# EAGLE design Motor_board (EAGLE 7.3.0)
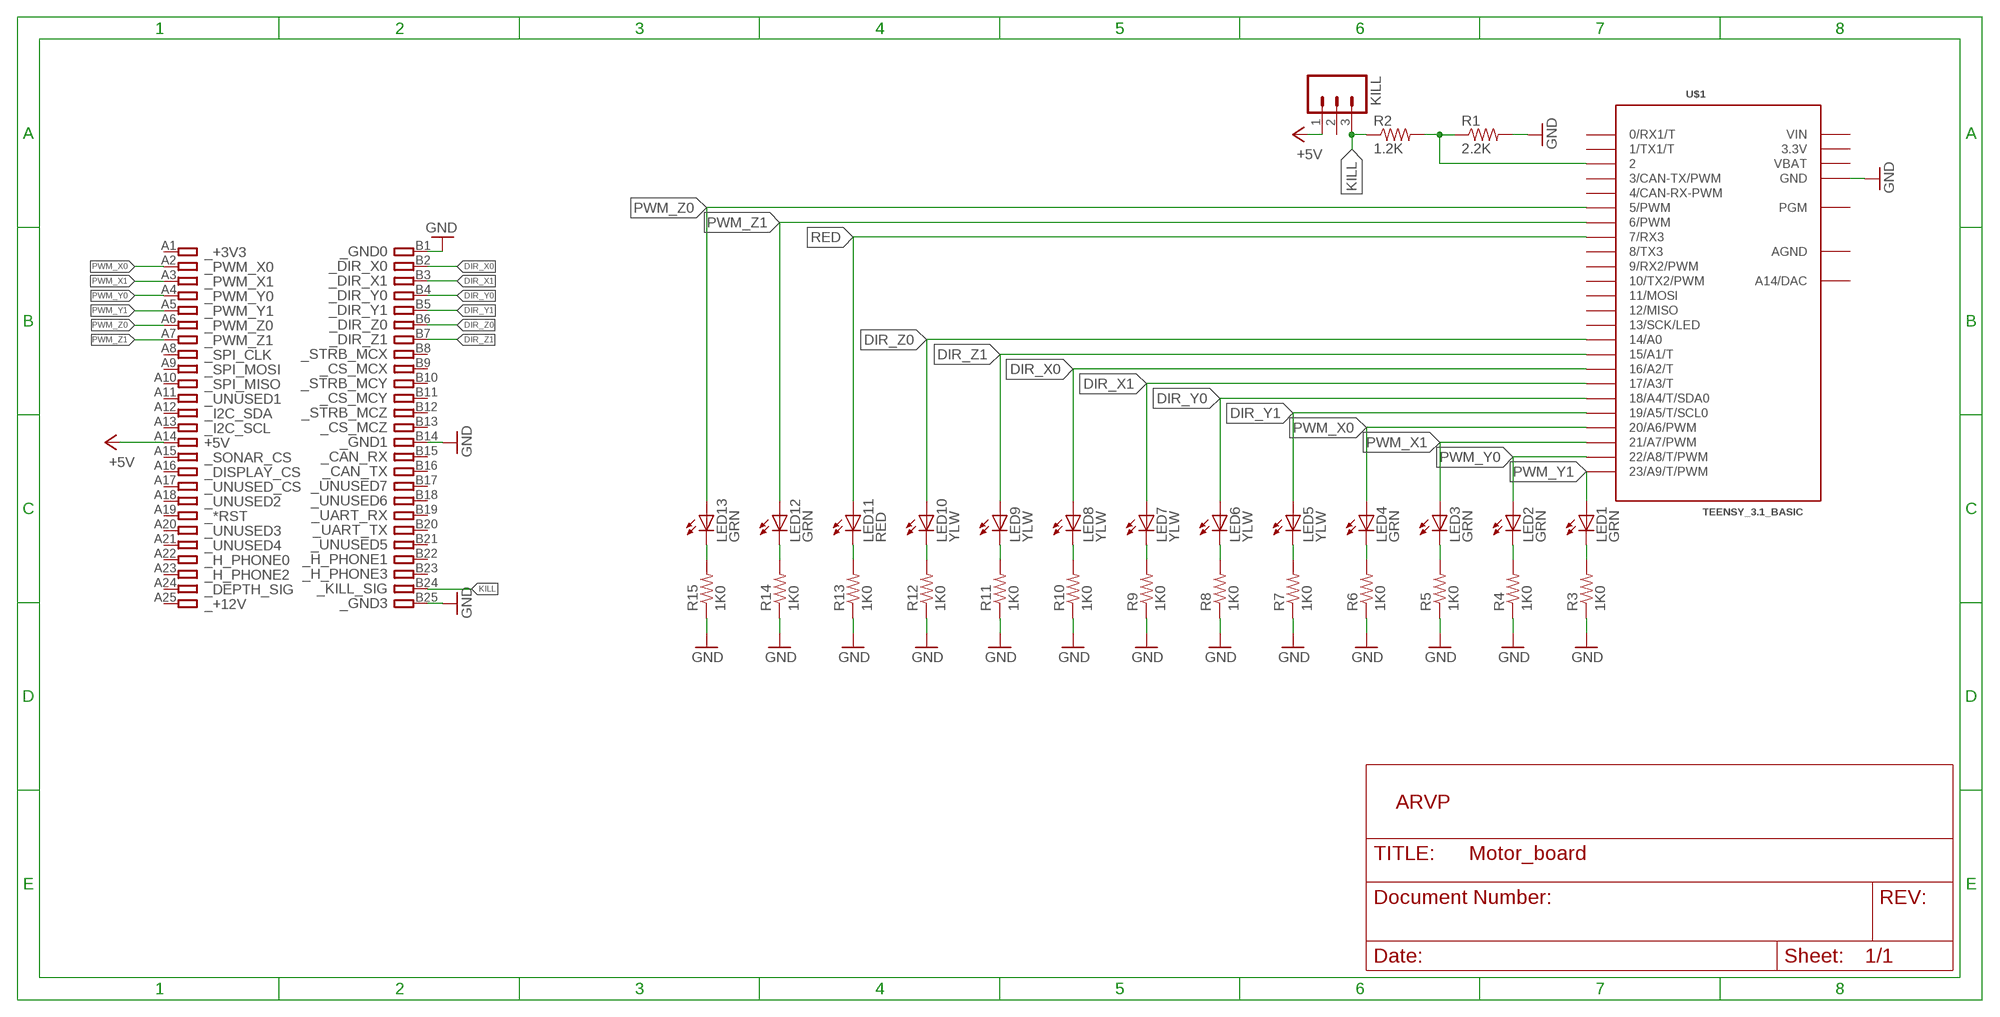
[diagram p0: schematic, sheet 1]

## Parts
KILL  M03LONGPADS  [1X03_LONGPADS]
LED1  GRN  LED1206  [LED-1206]
LED2  GRN  LED1206  [LED-1206]
LED3  GRN  LED1206  [LED-1206]
LED4  GRN  LED1206  [LED-1206]
LED5  YLW  LED1206  [LED-1206]
LED6  YLW  LED1206  [LED-1206]
LED7  YLW  LED1206  [LED-1206]
LED8  YLW  LED1206  [LED-1206]
LED9  YLW  LED1206  [LED-1206]
LED10  YLW  LED1206  [LED-1206]
LED11  RED  LED1206  [LED-1206]
LED12  GRN  LED1206  [LED-1206]
LED13  GRN  LED1206  [LED-1206]
R1  2.2K  RESISTOR1206  [1206]
R2  1.2K  RESISTOR1206  [1206]
R3  1K0  RESISTOR1206  [1206]
R4  1K0  RESISTOR1206  [1206]
R5  1K0  RESISTOR1206  [1206]
R6  1K0  RESISTOR1206  [1206]
R7  1K0  RESISTOR1206  [1206]
R8  1K0  RESISTOR1206  [1206]
R9  1K0  RESISTOR1206  [1206]
R10  1K0  RESISTOR1206  [1206]
R11  1K0  RESISTOR1206  [1206]
R12  1K0  RESISTOR1206  [1206]
R13  1K0  RESISTOR1206  [1206]
R14  1K0  RESISTOR1206  [1206]
R15  1K0  RESISTOR1206  [1206]
U$1  TEENSY_3.1_BASIC  [TEENSY_3.1_BASIC]
U$4  ARVP_LOGO  [ARVP]
U$19  CARD_50PIN  [CARD_50PIN]

## Nets
+5V: KILL.1 U$19.A14
DIR_X0: LED8.A U$1.16/A2(16/A2/T) U$19.B2
DIR_X1: LED7.A U$1.17/A3(17/A3/T) U$19.B3
DIR_Y0: LED6.A U$1.18/A4(18/A4/T/SDA0) U$19.B4
DIR_Y1: LED5.A U$1.19/A5(19/A5/T/SCL0) U$19.B5
DIR_Z0: LED10.A U$1.14/A0 U$19.B6
DIR_Z1: LED9.A U$1.15/A1(15/A1/T) U$19.B7
GND: R1.2 R3.1 R4.1 R5.1 R6.1 R7.1 R8.1 R9.1 R10.1 R11.1 R12.1 R13.1 R14.1 R15.1 U$1.GND U$1.GND1(GND) U$19.B1 U$19.B14 U$19.B25
KILL: KILL.3 R2.1 U$19.B24
N$1: LED1.C R3.2
N$2: LED2.C R4.2
N$3: LED3.C R5.2
N$4: LED4.C R6.2
N$5: LED5.C R7.2
N$6: LED6.C R8.2
N$7: LED7.C R9.2
N$8: LED8.C R10.2
N$9: R1.1 R2.2 U$1.2
N$11: LED12.C R14.2
N$12: LED11.C R13.2
N$17: LED9.C R11.2
N$18: LED10.C R12.2
N$21: LED13.C R15.2
PWM_X0: LED4.A U$1.20/A6(20/A6/PWM) U$19.A2
PWM_X1: LED3.A U$1.21/A7(21/A7/PWM) U$19.A3
PWM_Y0: LED2.A U$1.22/A8(22/A8/T/PWM) U$19.A4
PWM_Y1: LED1.A U$1.23/A9(23/A9/T/PWM) U$19.A5
PWM_Z0: LED13.A U$1.5(5/PWM) U$19.A6
PWM_Z1: LED12.A U$1.6(6/PWM) U$19.A7
RED: LED11.A U$1.7(7/RX3)
Unconnected: KILL.2 U$1.0(0/RX1/T) U$1.1(1/TX1/T) U$1.3(3/CAN-TX/PWM) U$1.4(4/CAN-RX-PWM) U$1.8(8/TX3) U$1.9(9/RX2/PWM) U$1.10(10/TX2/PWM) U$1.11(11/MOSI) U$1.12(12/MISO) U$1.13(13/SCK/LED) U$1.A14(A14/DAC) U$1.PGM U$19.A1 U$19.A8 U$19.A9 U$19.A10 U$19.A11 U$19.A12 U$19.A13 U$19.A15 U$19.A16 U$19.A17 U$19.A18 U$19.A19 U$19.A20 U$19.A21 U$19.A22 U$19.A23 U$19.A24 U$19.A25 U$19.B8 U$19.B9 U$19.B10 U$19.B11 U$19.B12 U$19.B13 U$19.B15 U$19.B16 U$19.B17 U$19.B18 U$19.B19 U$19.B20 U$19.B21 U$19.B22 U$19.B23

## Power pins joined to a net without a drawn wire
3.3V: U$1.3.3V U$1.3.3V1(3.3V)
AGND: U$1.AGND
VBAT: U$1.VBAT
VIN: U$1.VIN

## Library data of the parts
KILL = SparkFun:M03: Header 3 Standard 3-pin 0.1" header. Use with straight break away headers (SKU : PRT-00116), right angle break away headers (PRT-00553), swiss pins (PRT-00743), machine pins (PRT-00117), and female headers (PRT-00115). Molex polarized connector foot print use with SKU : PRT-08232 with associated crimp pins and housings.
LED1-LED13 = SparkFun:LED: LEDs Standard schematic elements and footprints for 5mm, 3mm, 1206, and 0603 sized LEDs. 5mm - Spark Fun Electronics SKU : COM-00529 (and others)
R1-R15 = SparkFun:RESISTOR: Resistor Basic schematic elements and footprints for 0603, 1206, and PTH resistors.
U$1 = Teensy_3_Series_Board_v1.0:TEENSY_3.1_BASIC: Footprint for Teensy 3.1 board using all pin connections on the outer perimeter
U$4 = ARVP:ARVP_LOGO
U$19 = ARVP:CARD_50PIN

## Net classes
0 default: width 0.305 mm, drill 0.508 mm, clearance 0.254 mm

## Board
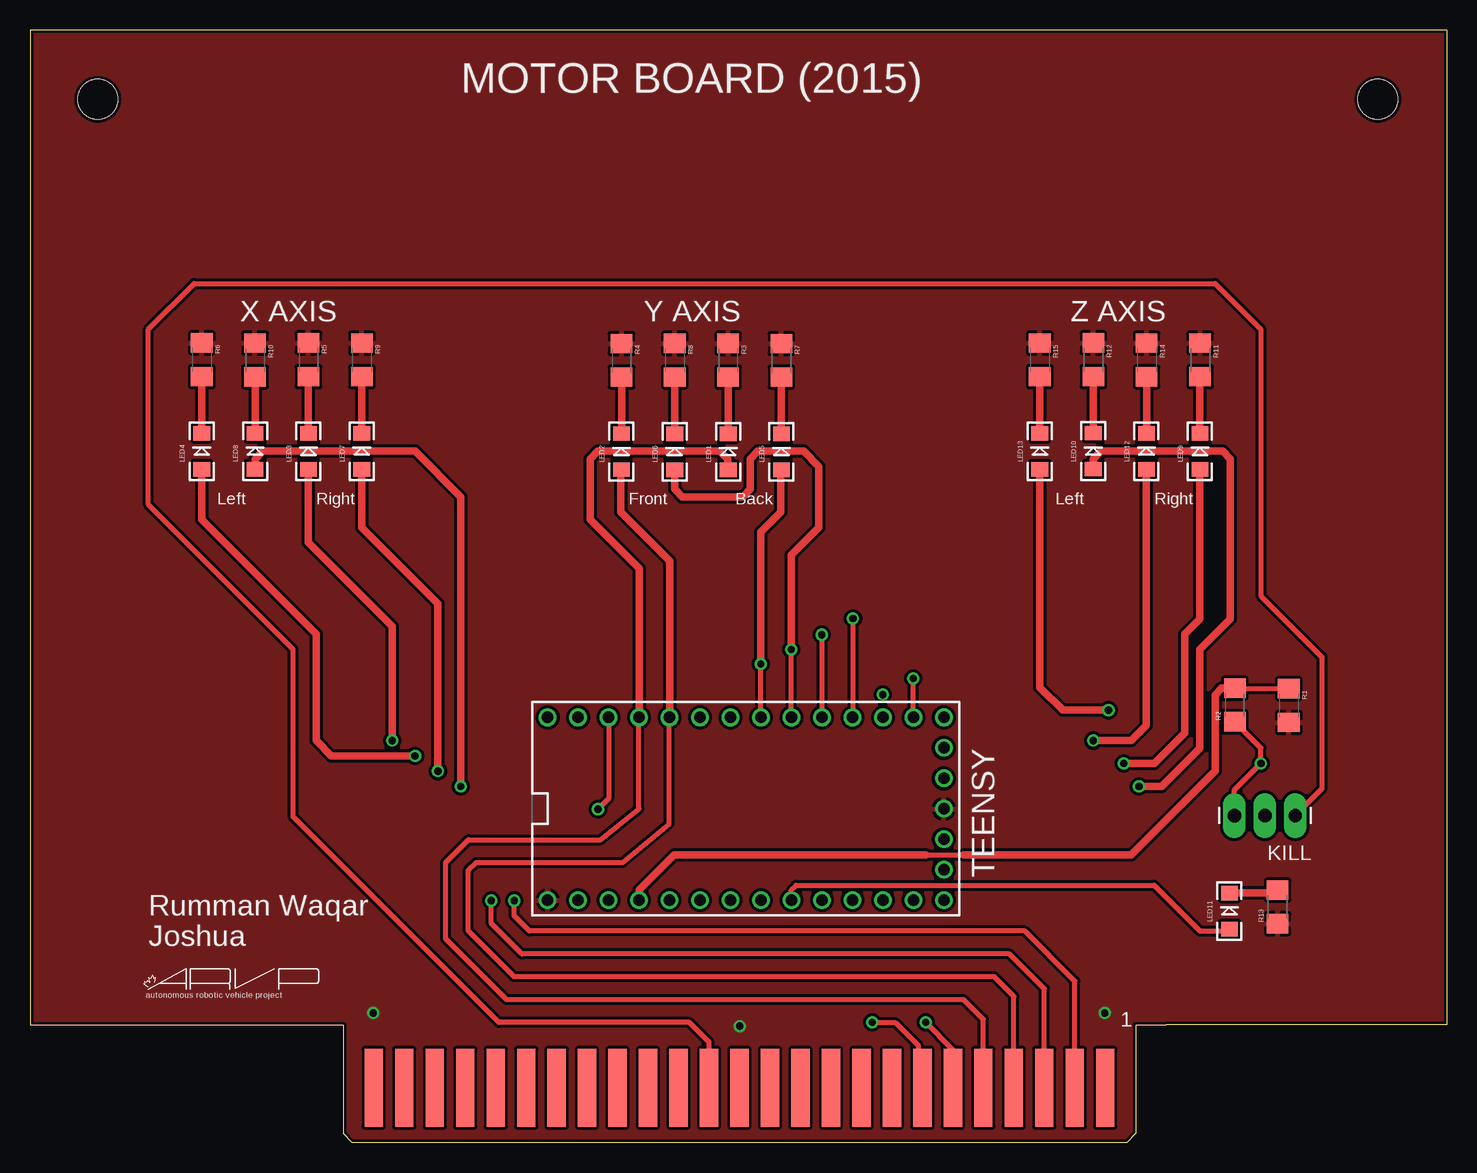
[diagram p1: board, top side]
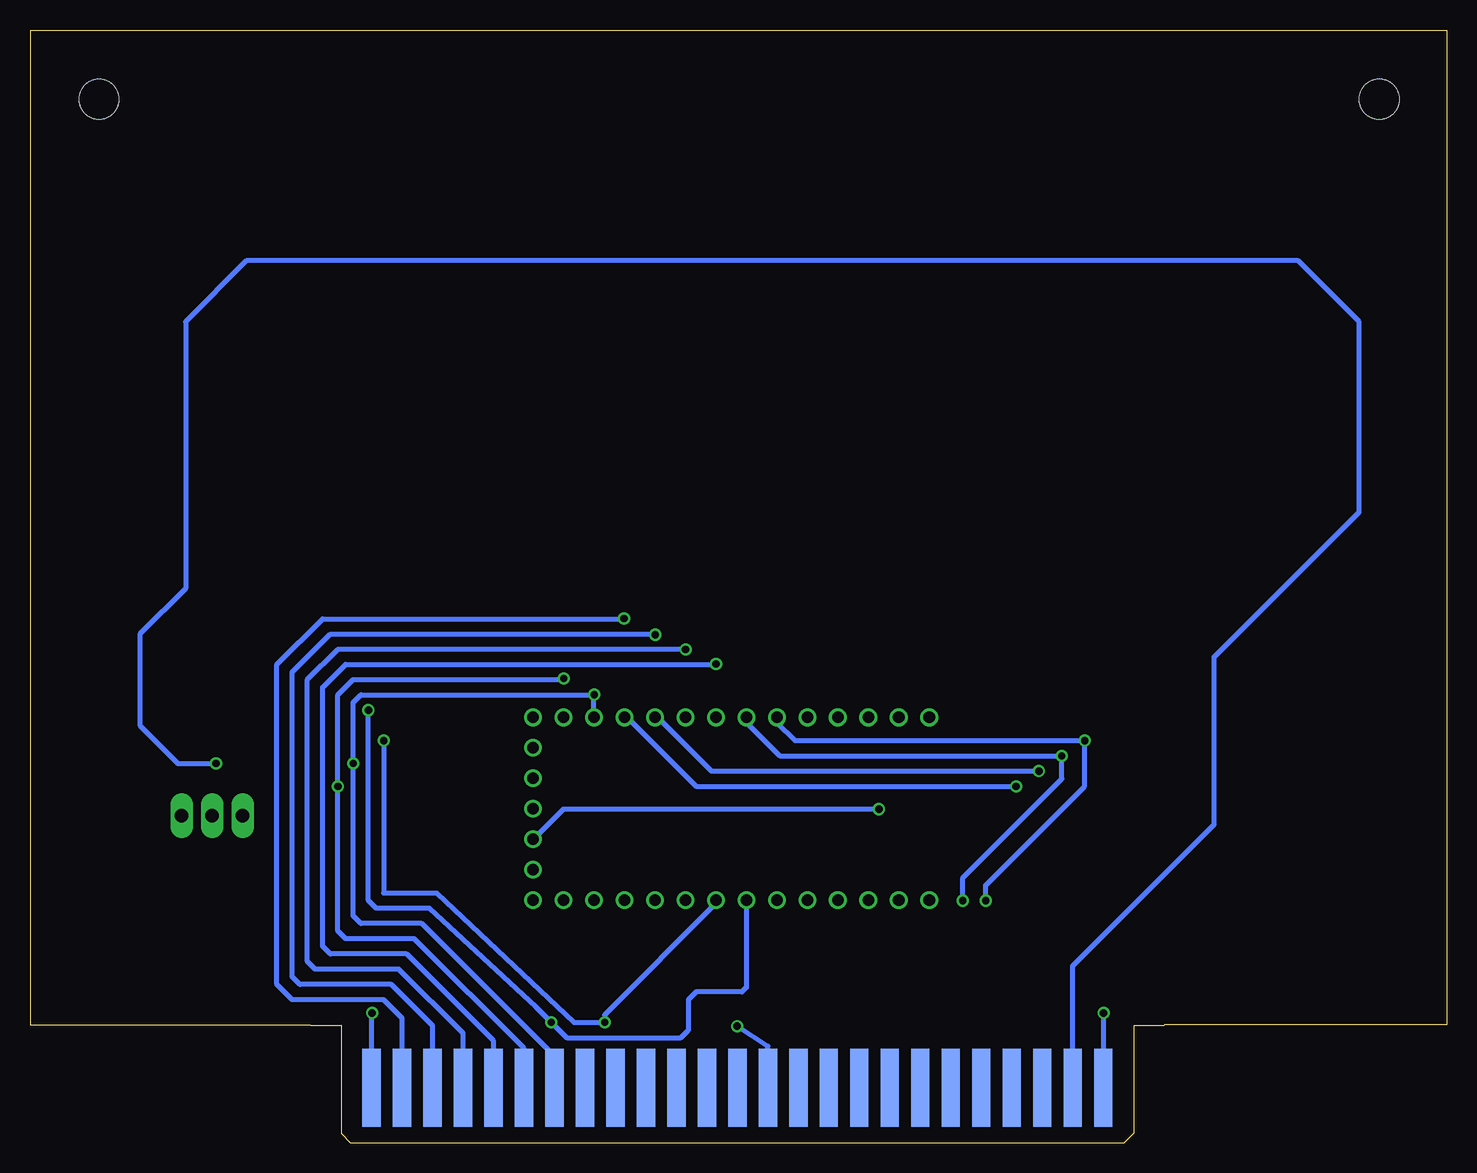
[diagram p2: board, bottom side, seen from below]

Size 118.08 x 92.75 mm. Coordinates in mm from the lower left corner, seen from the top.
Outline: 23.58,9.8 0.01,9.8 0,92.75 118.07,92.75 118.08,9.8 94.68,9.8
Copper layers (1*16): Top 0.035mm / dielectric 1.5mm / Bottom 0.035mm
Design rules "apcircuits": minimum track width 0.18mm, minimum drill 20mil, track to track 0.18mm, track to pad 0.18mm, pad to pad 0.18mm, via to via 0.18mm, smd to smd 0.18mm, copper to edge 0.25mm, drill to drill 0.25mm, minimum pad ring 10mil, minimum via ring 8mil, stop-mask expansion 4mil, vias tented up to drill 0mil, thermal gap 10mil

### Footprints (pad centres in the part's own frame; a part is rotated, then mirrored left to right if it is on the bottom)
STAND-OFF = hole 3.302: 0,0
1X03_LONGPADS = drill 1.118 pad 1.88 long: 1 0,0; 2 2.54,0; 3 5.08,0
LED-1206 = smd 1.2 x 1.4: A -1.5,0; C 1.5,0
1206 = smd 1.6 x 1.8: 1 -1.4,0; 2 1.4,0
TEENSY_3.1_BASIC = drill 0.965: 0 -7.62,13.97; 1 -7.62,11.43; 2 -7.62,8.89; 3 -7.62,6.35; 3.3V 7.62,11.43; 3.3V1 -2.54,-16.51; 4 -7.62,3.81; 5 -7.62,1.27; 6 -7.62,-1.27; 7 -7.62,-3.81; 8 -7.62,-6.35; 9 -7.62,-8.89; 10 -7.62,-11.43; 11 -7.62,-13.97; 12 -7.62,-16.51; 13 7.62,-16.51; 14/A0 7.62,-13.97; 15/A1 7.62,-11.43; 16/A2 7.62,-8.89; 17/A3 7.62,-6.35; 18/A4 7.62,-3.81; 19/A5 7.62,-1.27; 20/A6 7.62,1.27; 21/A7 7.62,3.81; 22/A8 7.62,6.35; 23/A9 7.62,8.89; A14 5.08,-16.51; AGND 7.62,13.97; GND -7.62,16.51; GND1 0,-16.51; PGM 2.54,-16.51; VBAT -5.08,-16.51; VIN 7.62,16.51
CARD_50PIN = smd 1.524 x 6.477: A1 30.48,5.08; A2 27.94,5.08; A3 25.4,5.08; A4 22.86,5.08; A5 20.32,5.08; A6 17.78,5.08; A7 15.24,5.08; A8 12.7,5.08; A9 10.16,5.08; A10 7.62,5.08; A11 5.08,5.08; A12 2.54,5.08; A13 0,5.08; A14 -2.54,5.08; A15 -5.08,5.08; A16 -7.62,5.08; A17 -10.16,5.08; A18 -12.7,5.08; A19 -15.24,5.08; A20 -17.78,5.08; A21 -20.32,5.08; A22 -22.86,5.08; A23 -25.4,5.08; A24 -27.94,5.08; A25 -30.48,5.08 | smd 1.524 x 6.477 bottom: B1 30.48,5.08; B2 27.94,5.08; B3 25.4,5.08; B4 22.86,5.08; B5 20.32,5.08; B6 17.78,5.08; B7 15.24,5.08; B8 12.7,5.08; B9 10.16,5.08; B10 7.62,5.08; B11 5.08,5.08; B12 2.54,5.08; B13 0,5.08; B14 -2.54,5.08; B15 -5.08,5.08; B16 -7.62,5.08; B17 -10.16,5.08; B18 -12.7,5.08; B19 -15.24,5.08; B20 -17.78,5.08; B21 -20.32,5.08; B22 -22.86,5.08; B23 -25.4,5.08; B24 -27.94,5.08; B25 -30.48,5.08

### Placement (x,y rotation side)
JP2  STAND-OFF  [STAND-OFF]  112.33,86.97 0 top
JP3  STAND-OFF  [STAND-OFF]  5.65,86.97 0 top
KILL  105.44,27.27 180 top
LED1  58.18,57.59 90 top
LED2  49.29,57.61 90 top
LED3  23.21,57.63 90 top
LED4  14.31,57.64 90 top
LED5  62.62,57.6 90 top
LED6  53.72,57.6 90 top
LED7  27.65,57.64 90 top
LED8  18.76,57.64 90 top
LED9  97.49,57.62 90 top
LED10  88.6,57.64 90 top
LED11  99.95,19.3 90 top
LED12  93.04,57.64 90 top
LED13  84.16,57.64 90 top
R1  104.89,36.43 270 top
R2  100.41,36.48 90 top
R3  58.17,65.22 270 top
R4  49.29,65.21 270 top
R5  23.2,65.26 270 top
R6  14.31,65.26 270 top
R7  62.62,65.21 270 top
R8  53.73,65.22 270 top
R9  27.65,65.25 270 top
R10  18.75,65.24 270 top
R11  97.51,65.25 270 top
R12  88.62,65.26 270 top
R13  103.97,19.65 90 top
R14  93.06,65.24 270 top
R15  84.15,65.25 270 top
U$1  59.65,27.82 90 top
U$4  9.62,12.05 0 top
U$19  59.13,-0.51 0 top

### Tracks (layer width: path | path; a pad name or v marks a point on that pad's centre or on a via)
3.3V  (via drill 0.6)
  Top 0.406: U$1.3.3V 48.22,28.68 v47.33,27.79
  Bottom 0.406: v47.33,27.79 73.65,27.79 U$1.3.3V1
+5V
  Top 0.406: U$19.A14 56.59,8.38 54.95,10.01 39.08,10.01 21.93,27.16 21.93,41.13 9.87,53.19 9.87,67.8 13.68,71.61 98.77,71.61 102.58,67.8 102.58,45.57 107.66,40.49 107.66,29.48 KILL.1
DIR_X0  (via drill 0.6)
  Top 0.406: v68.58,43.68 68.58,35.49 U$1.16/A2
  Top 0.61: v35.9,29.7 35.9,53.83 32.09,57.64 19.39,57.64 18.76,57 LED8.A | LED8.A
  Bottom 0.406: U$19.B2 87.07,10.38 88.61,11.92 96.23,11.92 97.5,13.19 97.5,39.86 93.69,43.67 68.59,43.67 v68.58,43.68 | U$1.16/A2 68.32,35.44 62.57,29.7 v35.9,29.7
DIR_X1  (via drill 0.6)
  Top 0.406: v65.97,42.33 65.97,35.47 U$1.17/A3
  Top 0.61: v34,30.97 34,44.94 27.65,51.29 LED7.A | LED7.A
  Bottom 0.406: U$19.B3 84.53,9.74 87.97,13.19 95.59,13.19 96.23,13.82 96.23,39.22 93.05,42.4 66.04,42.4 v65.97,42.33 | U$1.17/A3 65.78,35.44 61.3,30.97 v34,30.97
DIR_Y0  (via drill 0.6)
  Top 0.406: U$1.18/A4 63.46,41.1 v63.45,41.11
  Top 0.61: LED6.A 53.72,54.46 54.35,53.83 59.4,53.83 60.03,54.46 60.03,57 60.67,57.64 64.48,57.64 65.75,56.37 65.75,51.29 63.45,48.99 v63.45,41.11
  Bottom 0.406: U$19.B4 81.99,9.11 87.34,14.46 94.32,14.46 94.96,15.09 94.96,38.59 92.42,41.13 92.4,41.11 v63.45,41.11
DIR_Y1  (via drill 0.6)
  Top 0.406: U$1.19/A5 60.92,39.9 v60.91,39.91
  Top 0.61: 60.92,39.9 60.92,50.9 62.57,52.56 62.57,56.05 LED5.A
  Bottom 0.406: U$19.B5 79.45,8.47 86.7,15.73 93.05,15.73 93.69,16.36 93.69,37.95 91.78,39.86 60.96,39.86 v60.91,39.91
DIR_Z0  (via drill 0.6)
  Top 0.406: U$1.14/A0 v73.62,38.68 v73.61,38.69
  Top 0.61: LED10.A 88.6,57 89.24,57.64 99.4,57.64 100.04,57 100.04,43.67 97.5,41.13 97.5,32.87 94.32,29.7 v92.42,29.7
  Bottom 0.406: U$19.B6 76.91,7.84 86.07,17 91.78,17 92.42,17.63 v92.42,29.7 92.42,37.32 91.15,38.59 73.71,38.59 v73.61,38.69
DIR_Z1  (via drill 0.6)
  Top 0.61: v91.15,31.6 93.69,31.6 96.23,34.14 96.23,42.4 97.5,43.67 LED9.A
  Bottom 0.406: U$19.B7 74.37,7.2 85.43,18.27 90.51,18.27 91.15,18.9 v91.15,31.6 91.15,36.68 90.51,37.32 71.09,37.32 v71.07,37.34 71.08,37.33 U$1.15/A1
GND  (via drill 0.6)
  Bottom 0.406: U$19.B25 28.61,4.61 v28.61,10.8 | U$19.B1 89.61,10.76 v89.57,10.8 | U$19.B14 56.59,8.04 v59.15,9.71
  pour Top: -1.67,99.3 -1.67,-3.7 120.33,-3.7 120.33,100.3 -1.67,100.3
KILL  (via drill 0.6)
  Top 0.406: R2.1 102.58,32.91 v102.58,31.6 100.36,29.39 KILL.3
  Bottom 0.406: U$19.B24 31.19,14.73 19.39,26.52 19.39,40.49 7.33,52.56 7.33,68.43 12.41,73.51 100.04,73.51 105.12,68.43 105.12,46.21 108.93,42.4 108.93,34.78 105.75,31.6 v102.58,31.6
N$1
  Top 0.61: R3.2 58.17,59.11 LED1.C
N$2
  Top 0.61: R4.2 LED2.C
N$3
  Top 0.61: LED3.C R5.2
N$4
  Top 0.61: LED4.C R6.2
N$5
  Top 0.61: R7.2 LED5.C
N$6
  Top 0.61: R8.2 53.73,59.11 LED6.C
N$7
  Top 0.61: LED7.C 27.65,63.84 R9.2
N$8
  Top 0.61: LED8.C R10.2
N$9
  Top 0.406: R1.1 100.46,37.83 R2.2 | 74.64,23.98 77.81,23.98
  Top 0.61: R2.2 99.33,37.88 98.77,37.32 98.77,30.97 91.78,23.98 77.81,23.98 | U$1.2 50.76,21.06 53.68,23.98 74.64,23.98
N$11
  Top 0.61: R14.2 93.06,59.16 LED12.C
N$12
  Top 0.61: LED11.C 103.73,20.8 R13.2
N$17
  Top 0.61: LED9.C 97.49,63.83 R11.2
N$18
  Top 0.61: LED10.C 88.6,63.85 R12.2
N$21
  Top 0.406: 84.16,63.84 R15.2
  Top 0.61: R15.2 LED13.C
PWM_X0  (via drill 0.6)
  Top 0.406: v40.35,20.17 40.35,18.9 41.62,17.63 82.89,17.63 87.07,13.46 U$19.A2
  Top 0.61: v32.09,32.24 25.11,32.24 23.84,33.51 23.84,42.4 14.31,51.92 LED4.A | LED4.A
  Bottom 0.406: U$1.20/A6 58.38,35.03 55.59,32.24 v32.09,32.24 32.09,30.33 40.35,22.08 v40.35,20.17
PWM_X1  (via drill 0.6)
  Top 0.406: v38.44,20.17 38.44,18.27 40.98,15.73 81.62,15.73 84.53,12.82 U$19.A3
  Top 0.61: v30.19,33.51 30.19,43.03 23.2,50.02 LED3.A
  Bottom 0.406: U$1.21/A7 55.84,35.03 54.32,33.51 v30.19,33.51 30.19,29.7 38.44,21.44 v38.44,20.17
PWM_Y0
  Top 0.406: U$1.22/A8 53.26,35.41 53.26,26.58 49.39,23.35 37.17,23.35 36.54,22.71 36.54,17.63 40.35,13.82 80.35,13.82 81.99,12.19 U$19.A4
  Top 0.61: U$1.22/A8 53.3,48.49 49.24,52.56 49.24,56.06 LED2.A
PWM_Y1
  Top 0.406: U$19.A5 79.45,10.28 77.81,11.92 39.71,11.92 34.63,17 34.63,23.35 36.54,25.25 47.53,25.25 50.75,27.83 U$1.23/A9
  Top 0.61: U$1.23/A9 50.76,47.86 46.7,51.92 46.7,57 47.33,57.64 57.49,57.64 58.13,57 58.13,56.15 LED1.A
PWM_Z0  (via drill 0.6)
  Top 0.406: U$19.A6 76.91,7.74 v74.64,10.01
  Top 0.61: v89.88,36.05 86.07,36.05 84.16,37.95 LED13.A
  Bottom 0.406: v89.88,36.05 89.88,20.17 89.24,19.54 84.8,19.54 75.91,11.28 v74.64,10.01 73.37,8.74 63.84,8.74 63.21,9.38 63.21,11.92 62.57,12.55 58.76,12.55 58.38,12.93 U$1.5
PWM_Z1  (via drill 0.6)
  Top 0.406: v70.19,10.01 72.1,10.01 74,8.11 74,4.94 U$19.A7
  Top 0.61: LED12.A 93.04,34.76 91.78,33.51 v88.61,33.51
  Bottom 0.406: v88.61,33.51 88.61,20.81 84.16,20.81 72.73,10.01 v70.19,10.01 70.19,10.65 60.92,19.92 U$1.6
RED
  Top 0.406: U$1.7 63.46,21.06 63.84,21.44 93.69,21.44 97.5,17.63 99.78,17.63 LED11.A

### Text on the board
tPlace: MOTOR BOARD (2015) | X AXIS | Y AXIS | Z AXIS | Left | Right | Front | Back | Left | Right | TEENSY | Rumman Waqar | Joshua